# EAGLE schematic v1 (EAGLE 7.3.0)
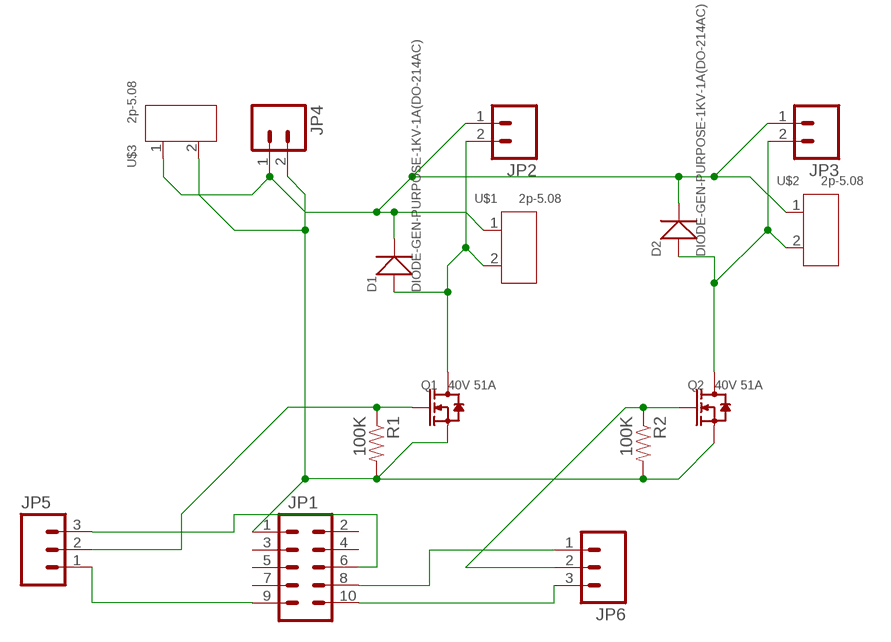
[diagram p0: schematic, sheet 1]

## Parts
D1  DIODE-GEN-PURPOSE-1KV-1A(DO-214AC)  [DO-214AC]
D2  DIODE-GEN-PURPOSE-1KV-1A(DO-214AC)  [DO-214AC]
JP1  M05X2PTH  [AVR_ICSP]
JP2  M02POLAR  [MOLEX-1X2]
JP3  M02POLAR  [MOLEX-1X2]
JP4  M02POLAR  [MOLEX-1X2]
JP5  M03PTH  [1X03]
JP6  M03PTH  [1X03]
Q1  40V 51A  SMD-MOSFET-HIGH-POWER-N-CH-40V-51A(DPAK)  [DPAK]
Q2  40V 51A  SMD-MOSFET-HIGH-POWER-N-CH-40V-51A(DPAK)  [DPAK]
R1  100K  RESISTOR0805-RES  [0805]
R2  100K  RESISTOR0805-RES  [0805]
U$1  2p-5.08  DIP-BLUE-SCREW-TERMINAL(2P-5.08)  [H2-5.0-10.5X8.0MM]
U$2  2p-5.08  DIP-BLUE-SCREW-TERMINAL(2P-5.08)  [H2-5.0-10.5X8.0MM]
U$3  2p-5.08  DIP-BLUE-SCREW-TERMINAL(2P-5.08)  [H2-5.0-10.5X8.0MM]

## Nets
GND: JP1.1 JP4.2 Q1.2(S) Q2.2(S) R1.2 R2.2 U$3.2
N$1: D1.2(-) D2.2(-) JP2.1 JP3.1 JP4.1 U$1.1 U$2.1 U$3.1
N$2: D2.1(+) JP3.2 Q2.3(D) U$2.2
N$3: D1.1(+) JP2.2 Q1.3(D) U$1.2
N$4: JP5.2 Q1.1(G) R1.1
N$5: JP6.2 Q2.1(G) R2.1
N$6: JP1.9 JP5.1
N$7: JP1.10 JP6.3
N$8: JP1.6 JP5.3
N$9: JP1.8 JP6.1
Unconnected: JP1.2 JP1.3 JP1.4 JP1.5 JP1.7

## Library data of the parts
D1 D2 = Seeed-OPL-Diode:DIODE-GEN-PURPOSE-1KV-1A(DO-214AC): 304010013; MPN: 1N4007
JP1 = SparkFun-Connectors:M05X2: Header 5x2 Standard 10-pin dual row 0.1" header. Commonly used with AVR-ISP. Use with Spark Fun Electronics SKU: PRT-00778
JP2-JP4 = SparkFun-Connectors:M02: Standard 2-pin 0.1" header. Use with - straight break away headers ( PRT-00116) - right angle break away headers (PRT-00553) - swiss pins (PRT-00743) - machine pins (PRT-00117) - female headers (PRT-00115) Molex polarized connector foot print use with: PRT-08233 with associated crimp pins and housings. 2.54_SCREWTERM for use with PRT-10571. 3.5mm Screw Terminal footprints for PRT-08084 5mm Screw Terminal footprints for use with PRT-08432
JP5 JP6 = SparkFun-Connectors:M03: Header 3 Standard 3-pin 0.1" header. Use with straight break away headers (SKU : PRT-00116), right angle break away headers (PRT-00553), swiss pins (PRT-00743), machine pins (PRT-00117), and female headers (PRT-00115). Molex polarized connector foot print use with SKU : PRT-08232 with associated crimp pins and housings.
Q1 Q2 = Seeed-OPL-Transistor:SMD-MOSFET-HIGH-POWER-N-CH-40V-51A(DPAK): 305030078; MPN: NTD5805NT4G
R1 R2 = SparkFun-Passives:RESISTOR: Resistor Basic schematic elements and footprints for 0603, 1206, and PTH resistors.
U$1-U$3 = Seeed-OPL-Connector:DIP-BLUE-SCREW-TERMINAL(2P-5.08): 320110006; MPN: GS009S-2P-2